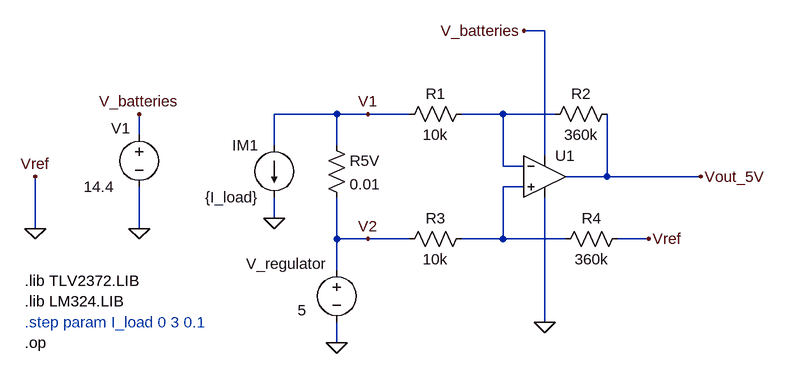
[diagram p0: schematic current_sense_interfaceSINGLElogic.asc]
current_sense_interfaceSINGLElogic.asc, the LTspice schematic file:
Version 4
SHEET 1 880 680
WIRE 384 -80 352 -80
WIRE 64 48 -32 48
WIRE 112 48 64 48
WIRE 176 48 112 48
WIRE 320 48 256 48
WIRE 400 48 320 48
WIRE -240 80 -240 48
WIRE -32 96 -32 48
WIRE 64 96 64 48
WIRE 384 112 384 -80
WIRE 320 128 320 48
WIRE 352 128 320 128
WIRE 480 144 480 48
WIRE 480 144 416 144
WIRE 624 144 480 144
WIRE 352 160 320 160
WIRE -32 208 -32 176
WIRE -400 224 -400 144
WIRE -240 224 -240 160
WIRE 64 240 64 176
WIRE 112 240 64 240
WIRE 176 240 112 240
WIRE 320 240 320 160
WIRE 320 240 256 240
WIRE 416 240 320 240
WIRE 544 240 496 240
WIRE 64 288 64 240
WIRE 384 368 384 176
WIRE 64 400 64 368
FLAG -32 208 0
FLAG 624 144 Vout_5V
FLAG 544 240 Vref
FLAG 112 240 V2
FLAG 112 48 V1
FLAG 352 -80 V_batteries
FLAG 384 368 0
FLAG -240 224 0
FLAG -400 144 Vref
FLAG -400 224 0
FLAG -240 48 V_batteries
FLAG 64 400 0
SYMBOL res 496 32 R90
WINDOW 0 0 56 VBottom 2
WINDOW 3 32 56 VTop 2
SYMATTR InstName R2
SYMATTR Value 360k
SYMATTR SpiceLine tol=1 pwr=0.6
SYMBOL res 512 224 R90
WINDOW 0 0 56 VBottom 2
WINDOW 3 32 56 VTop 2
SYMATTR InstName R4
SYMATTR Value 360k
SYMATTR SpiceLine tol=1 pwr=0.6
SYMBOL res 272 224 R90
WINDOW 0 0 56 VBottom 2
WINDOW 3 32 56 VTop 2
SYMATTR InstName R3
SYMATTR Value 10k
SYMATTR SpiceLine tol=1 pwr=0.6
SYMBOL res 272 32 R90
WINDOW 0 0 56 VBottom 2
WINDOW 3 32 56 VTop 2
SYMATTR InstName R1
SYMATTR Value 10k
SYMATTR SpiceLine tol=1 pwr=0.6
SYMBOL res 48 80 R0
SYMATTR InstName R5V
SYMATTR Value 0.01
SYMATTR SpiceLine tol=1 pwr=1
SYMBOL current -32 96 M0
WINDOW 123 24 108 Left 2
WINDOW 39 0 0 Left 0
SYMATTR InstName IM1
SYMATTR Value {I_load}
SYMBOL OpAmps\\opamp2 384 80 R0
WINDOW 3 16 96 Invisible 2
SYMATTR InstName U1
SYMATTR Value2 LM324
SYMBOL voltage -240 64 R0
WINDOW 0 -14 6 Right 2
WINDOW 3 -85 96 Left 2
WINDOW 123 0 0 Left 0
WINDOW 39 0 0 Left 0
SYMATTR InstName V1
SYMATTR Value 14.4
SYMBOL voltage 64 272 R0
WINDOW 0 -14 6 Right 2
WINDOW 3 -60 78 Left 2
WINDOW 123 0 0 Left 0
WINDOW 39 0 0 Left 0
SYMATTR InstName V_regulator
SYMATTR Value 5
TEXT -416 368 Left 2 ;.step param I_load 0 3 0.1
TEXT -416 304 Left 2 !.lib TLV2372.LIB
TEXT -416 336 Left 2 !.lib LM324.LIB
TEXT -416 400 Left 2 !.op

The netlist it stands for:
* current_sense_interfaceSINGLElogic.asc
R2 Vout_5V N001 360k tol=1 pwr=0.6
R4 0 N002 360k tol=1 pwr=0.6
R3 N002 V2 10k tol=1 pwr=0.6
R1 N001 V1 10k tol=1 pwr=0.6
R5V V1 V2 0.01 tol=1 pwr=1
IM1 V1 0 {I_load}
XU1 N002 N001 V_batteries 0 Vout_5V opamp2 LM324  ; pins In+ In- V+ V- OUT
V1 V_batteries 0 14.4
V_regulator V2 0 5
* .step param I_load 0 3 0.1
.lib TLV2372.LIB
.lib LM324.LIB
.op
.backanno
.end